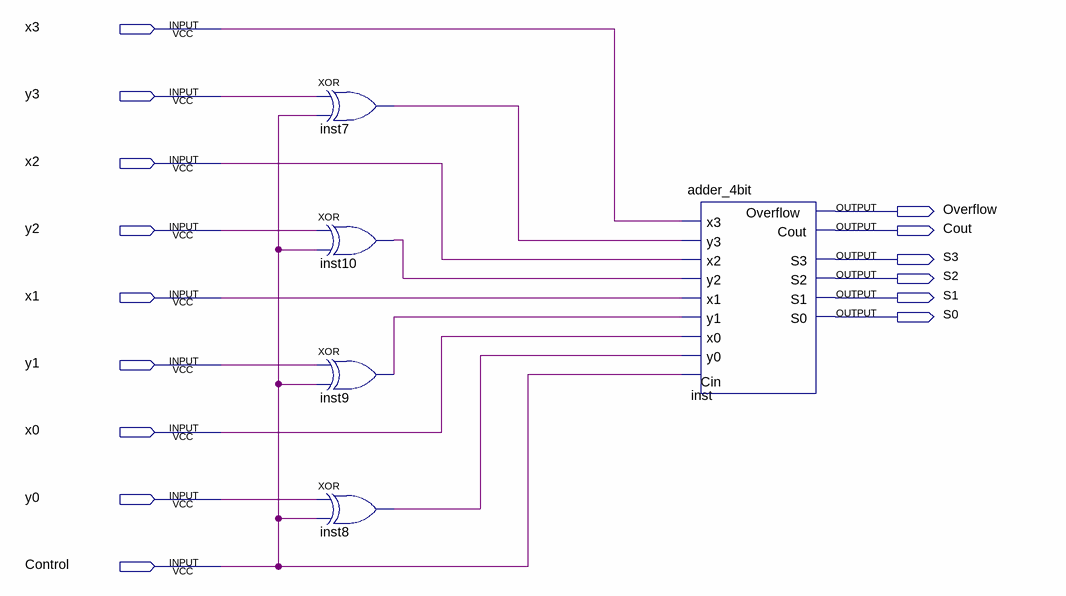
[diagram p0: schematic sheet]
// Quartus schematic add_sub.bdf as structural Verilog: 5 symbols, 15 pins
module add_sub (
  input  x3,
  input  y3,
  input  x2,
  input  y2,
  input  x1,
  input  y1,
  input  x0,
  input  y0,
  input  Control,
  output Overflow,
  output Cout,
  output S3,
  output S2,
  output S1,
  output S0
);

  wire inst7_out, inst8_out, inst9_out, inst10_out;

  xor inst7 (inst7_out, y3, Control);
  xor inst10 (inst10_out, y2, Control);
  xor inst9 (inst9_out, y1, Control);
  xor inst8 (inst8_out, y0, Control);
  adder_4bit inst (
    .x3(x3), .y3(inst7_out), .x2(x2), .y2(inst10_out), .x1(x1), .y1(inst9_out), .Cin(Control), .x0(x0),
    .y0(inst8_out), .S3(S3), .Cout(Cout), .Overflow(Overflow), .S2(S2), .S1(S1), .S0(S0));
endmodule
